# EAGLE schematic zik-pcb-sbc-ez80stm100p-r3 (EAGLE 6.5.0)
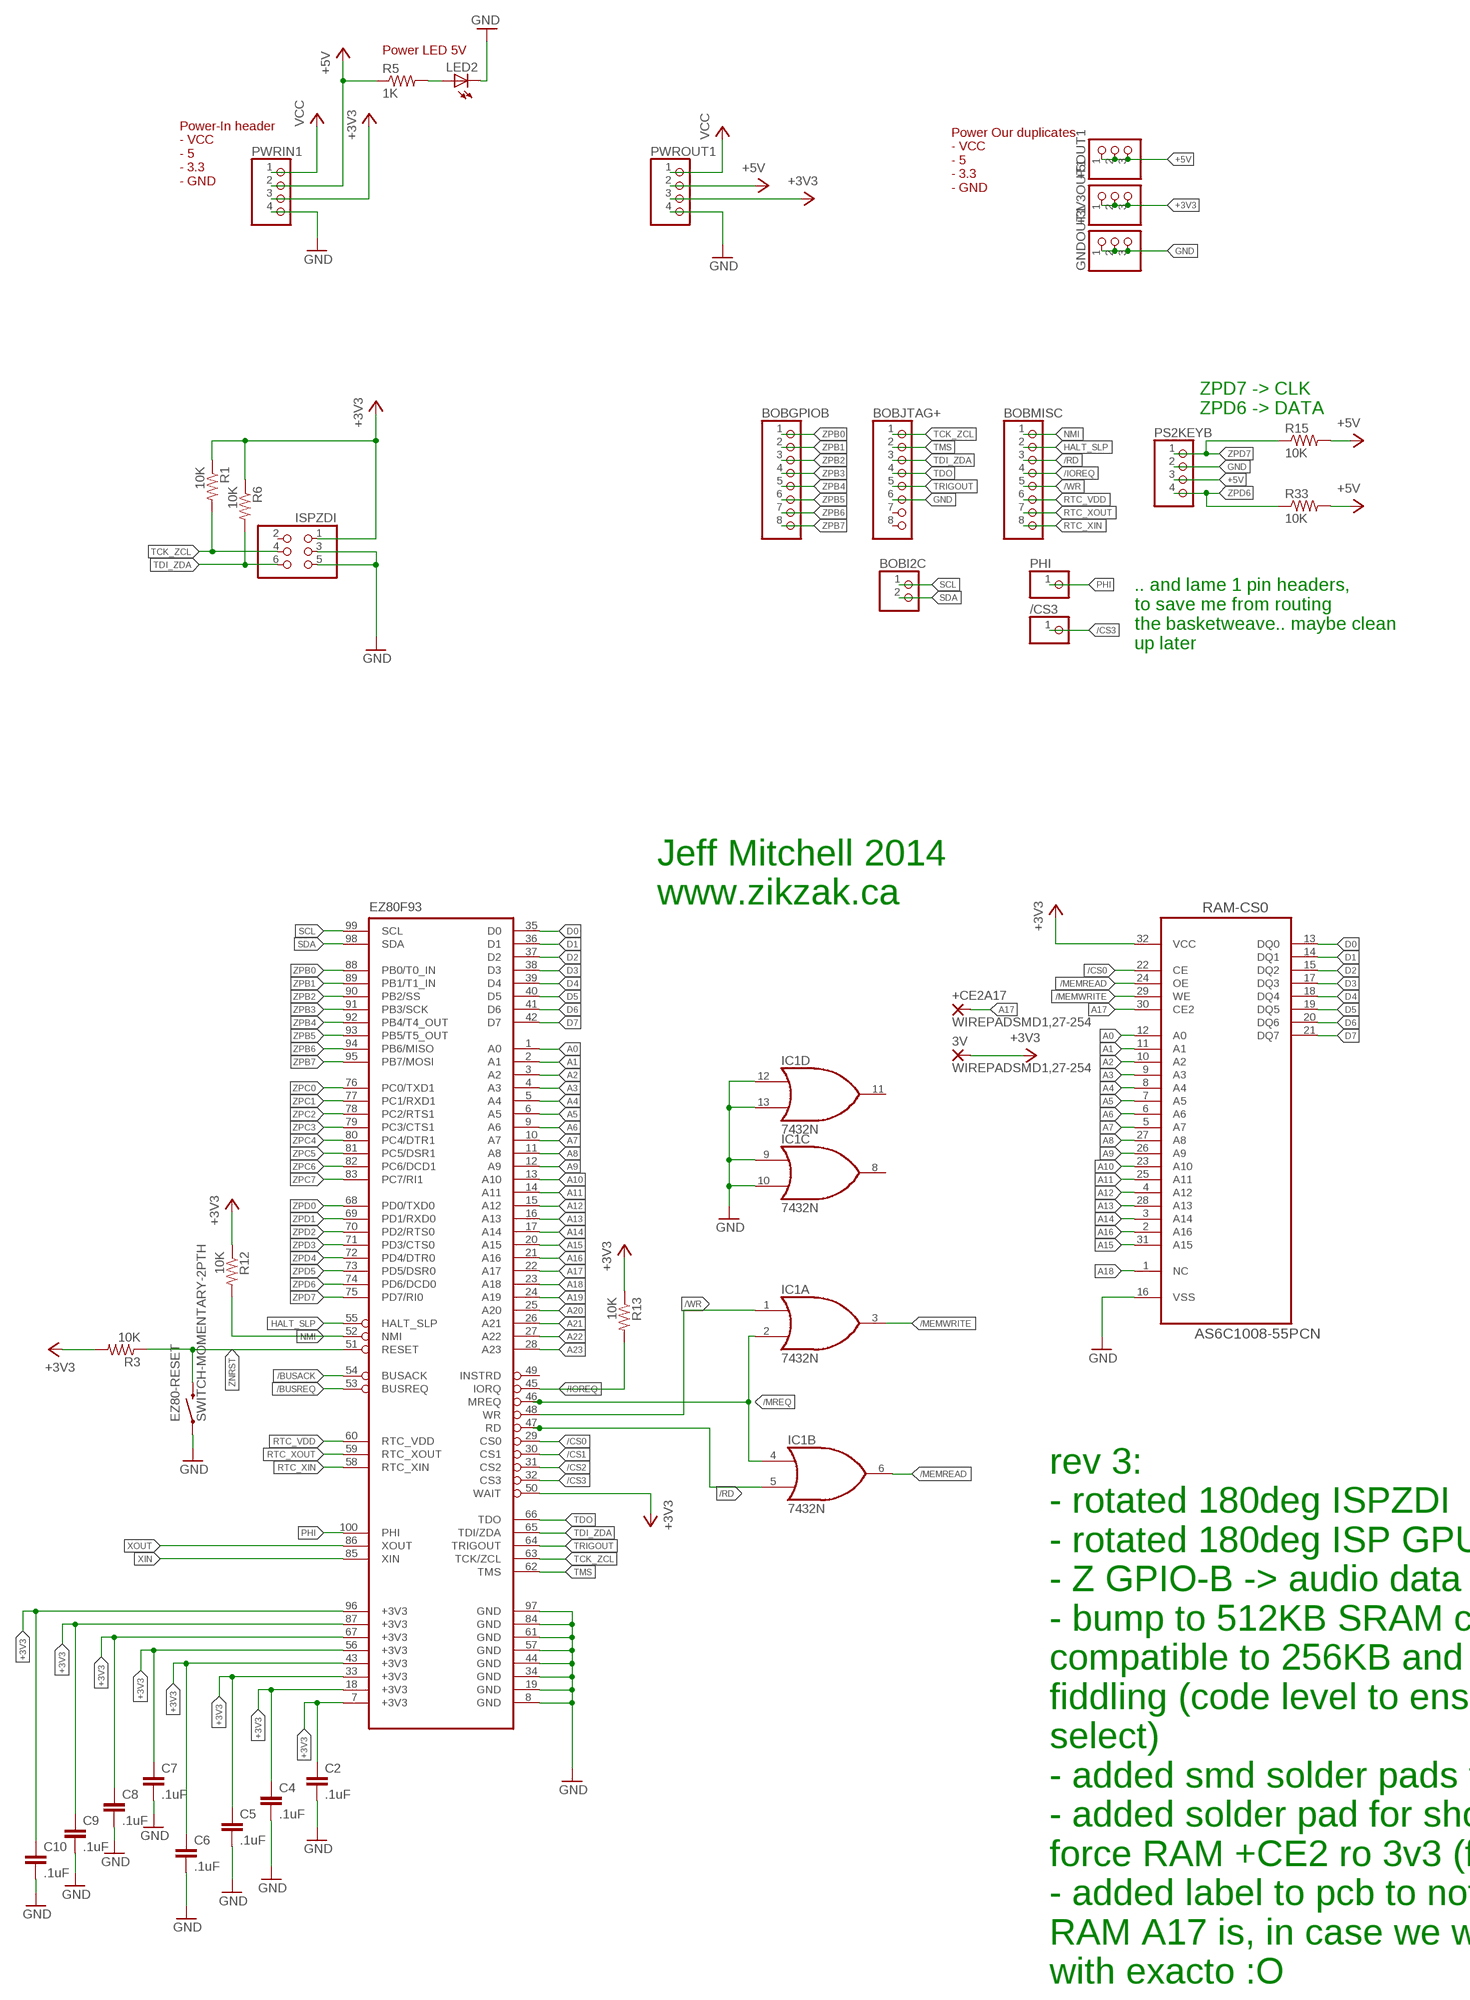
[diagram p0: schematic, sheet 1, part 1 of 3]
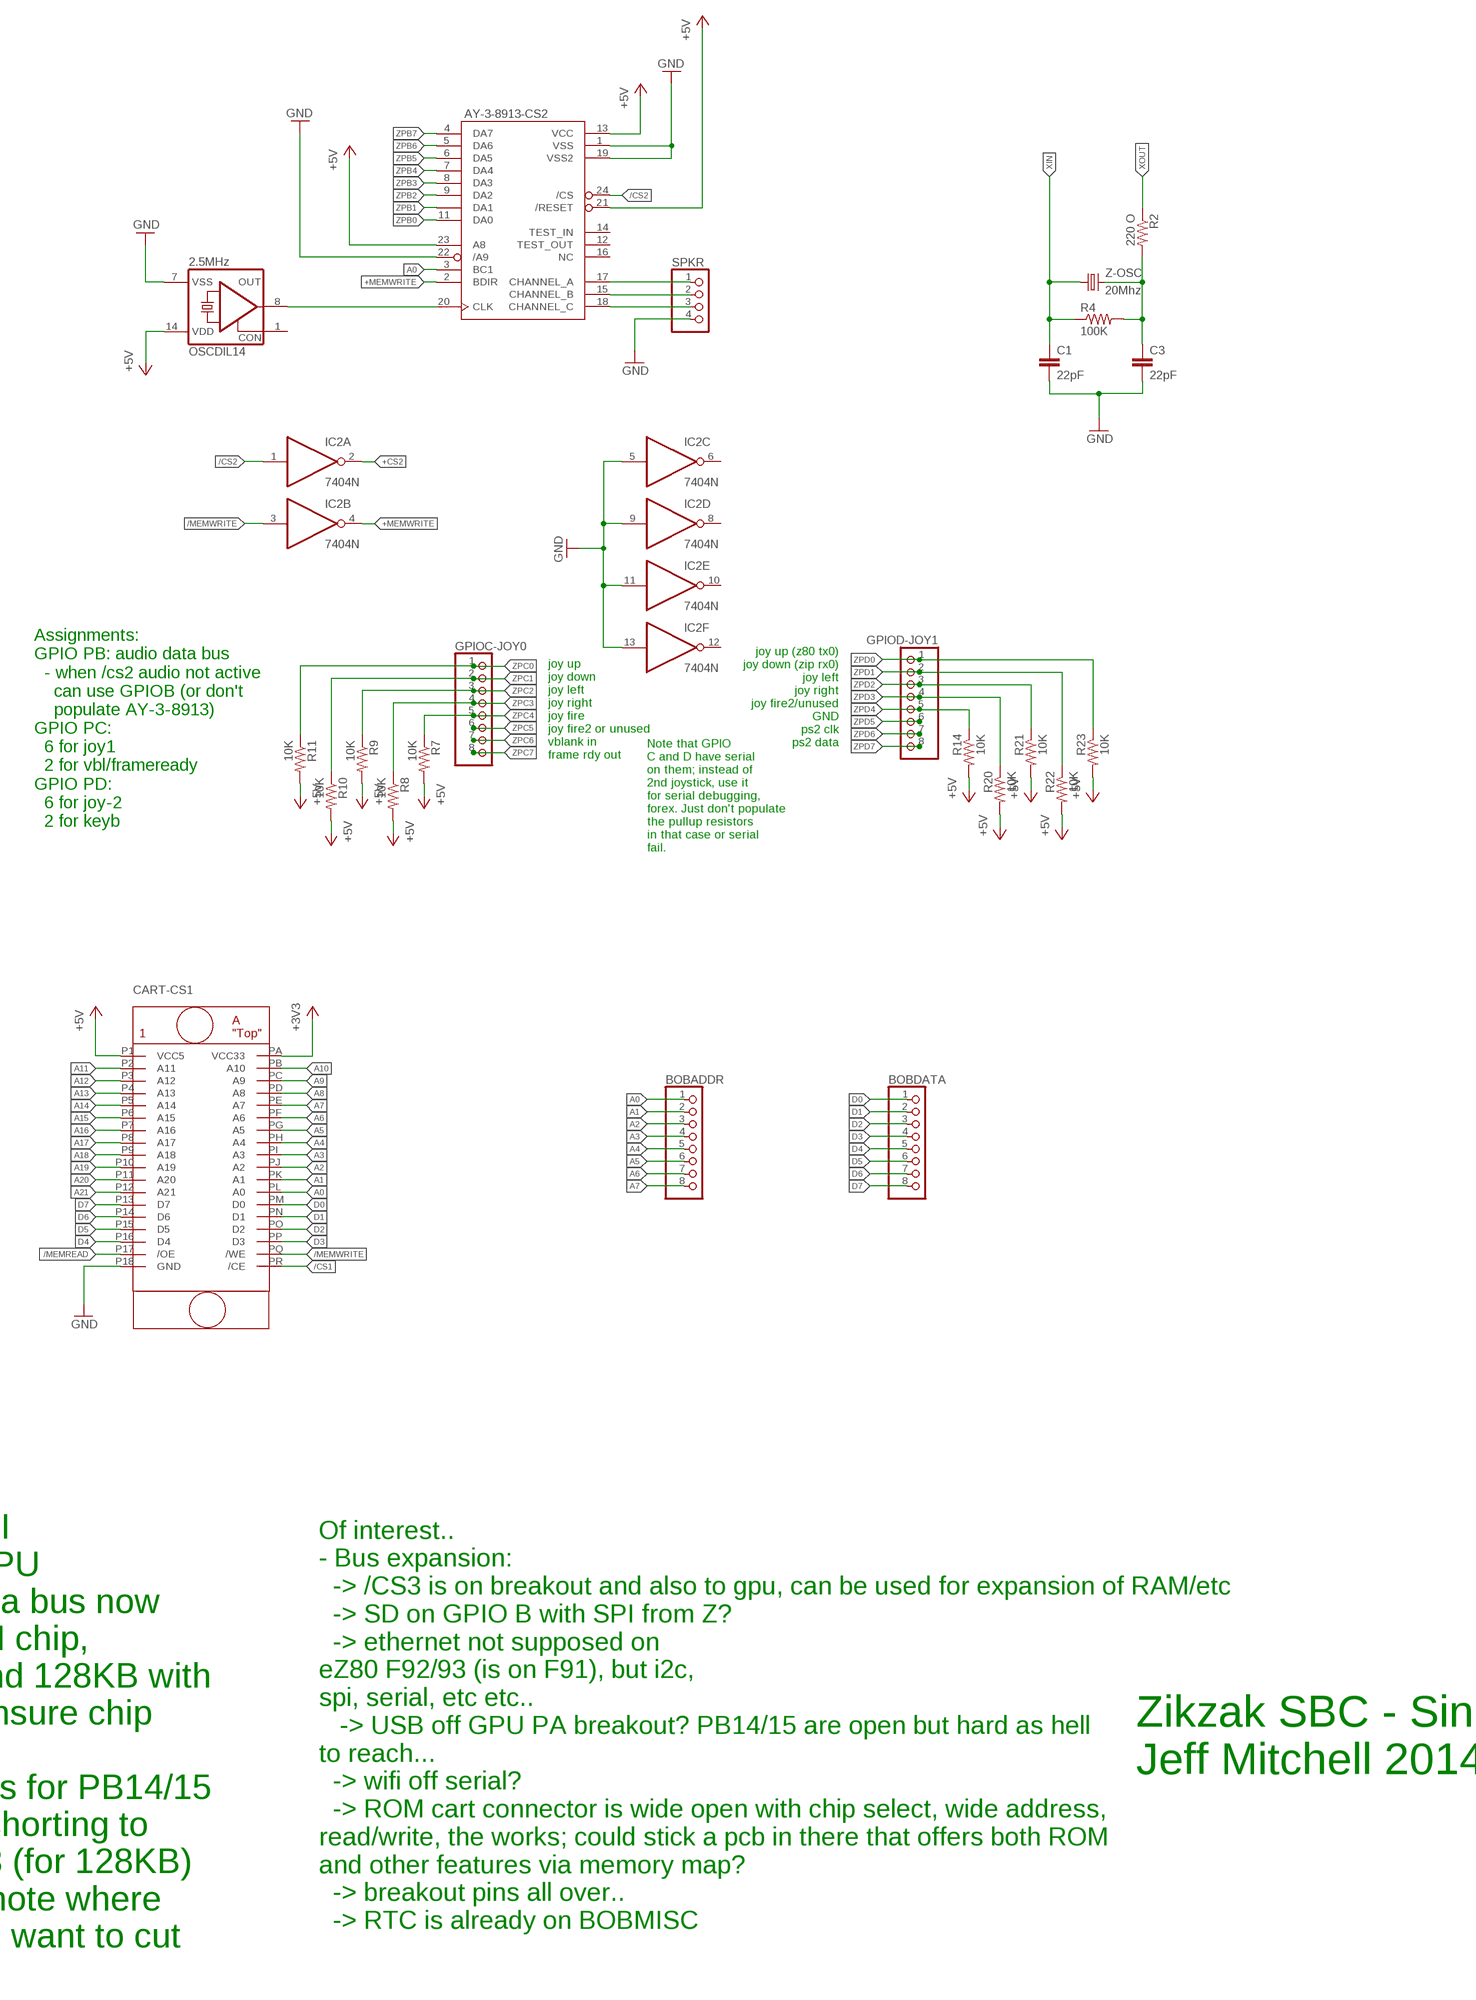
[diagram p1: schematic, sheet 1, part 2 of 3]
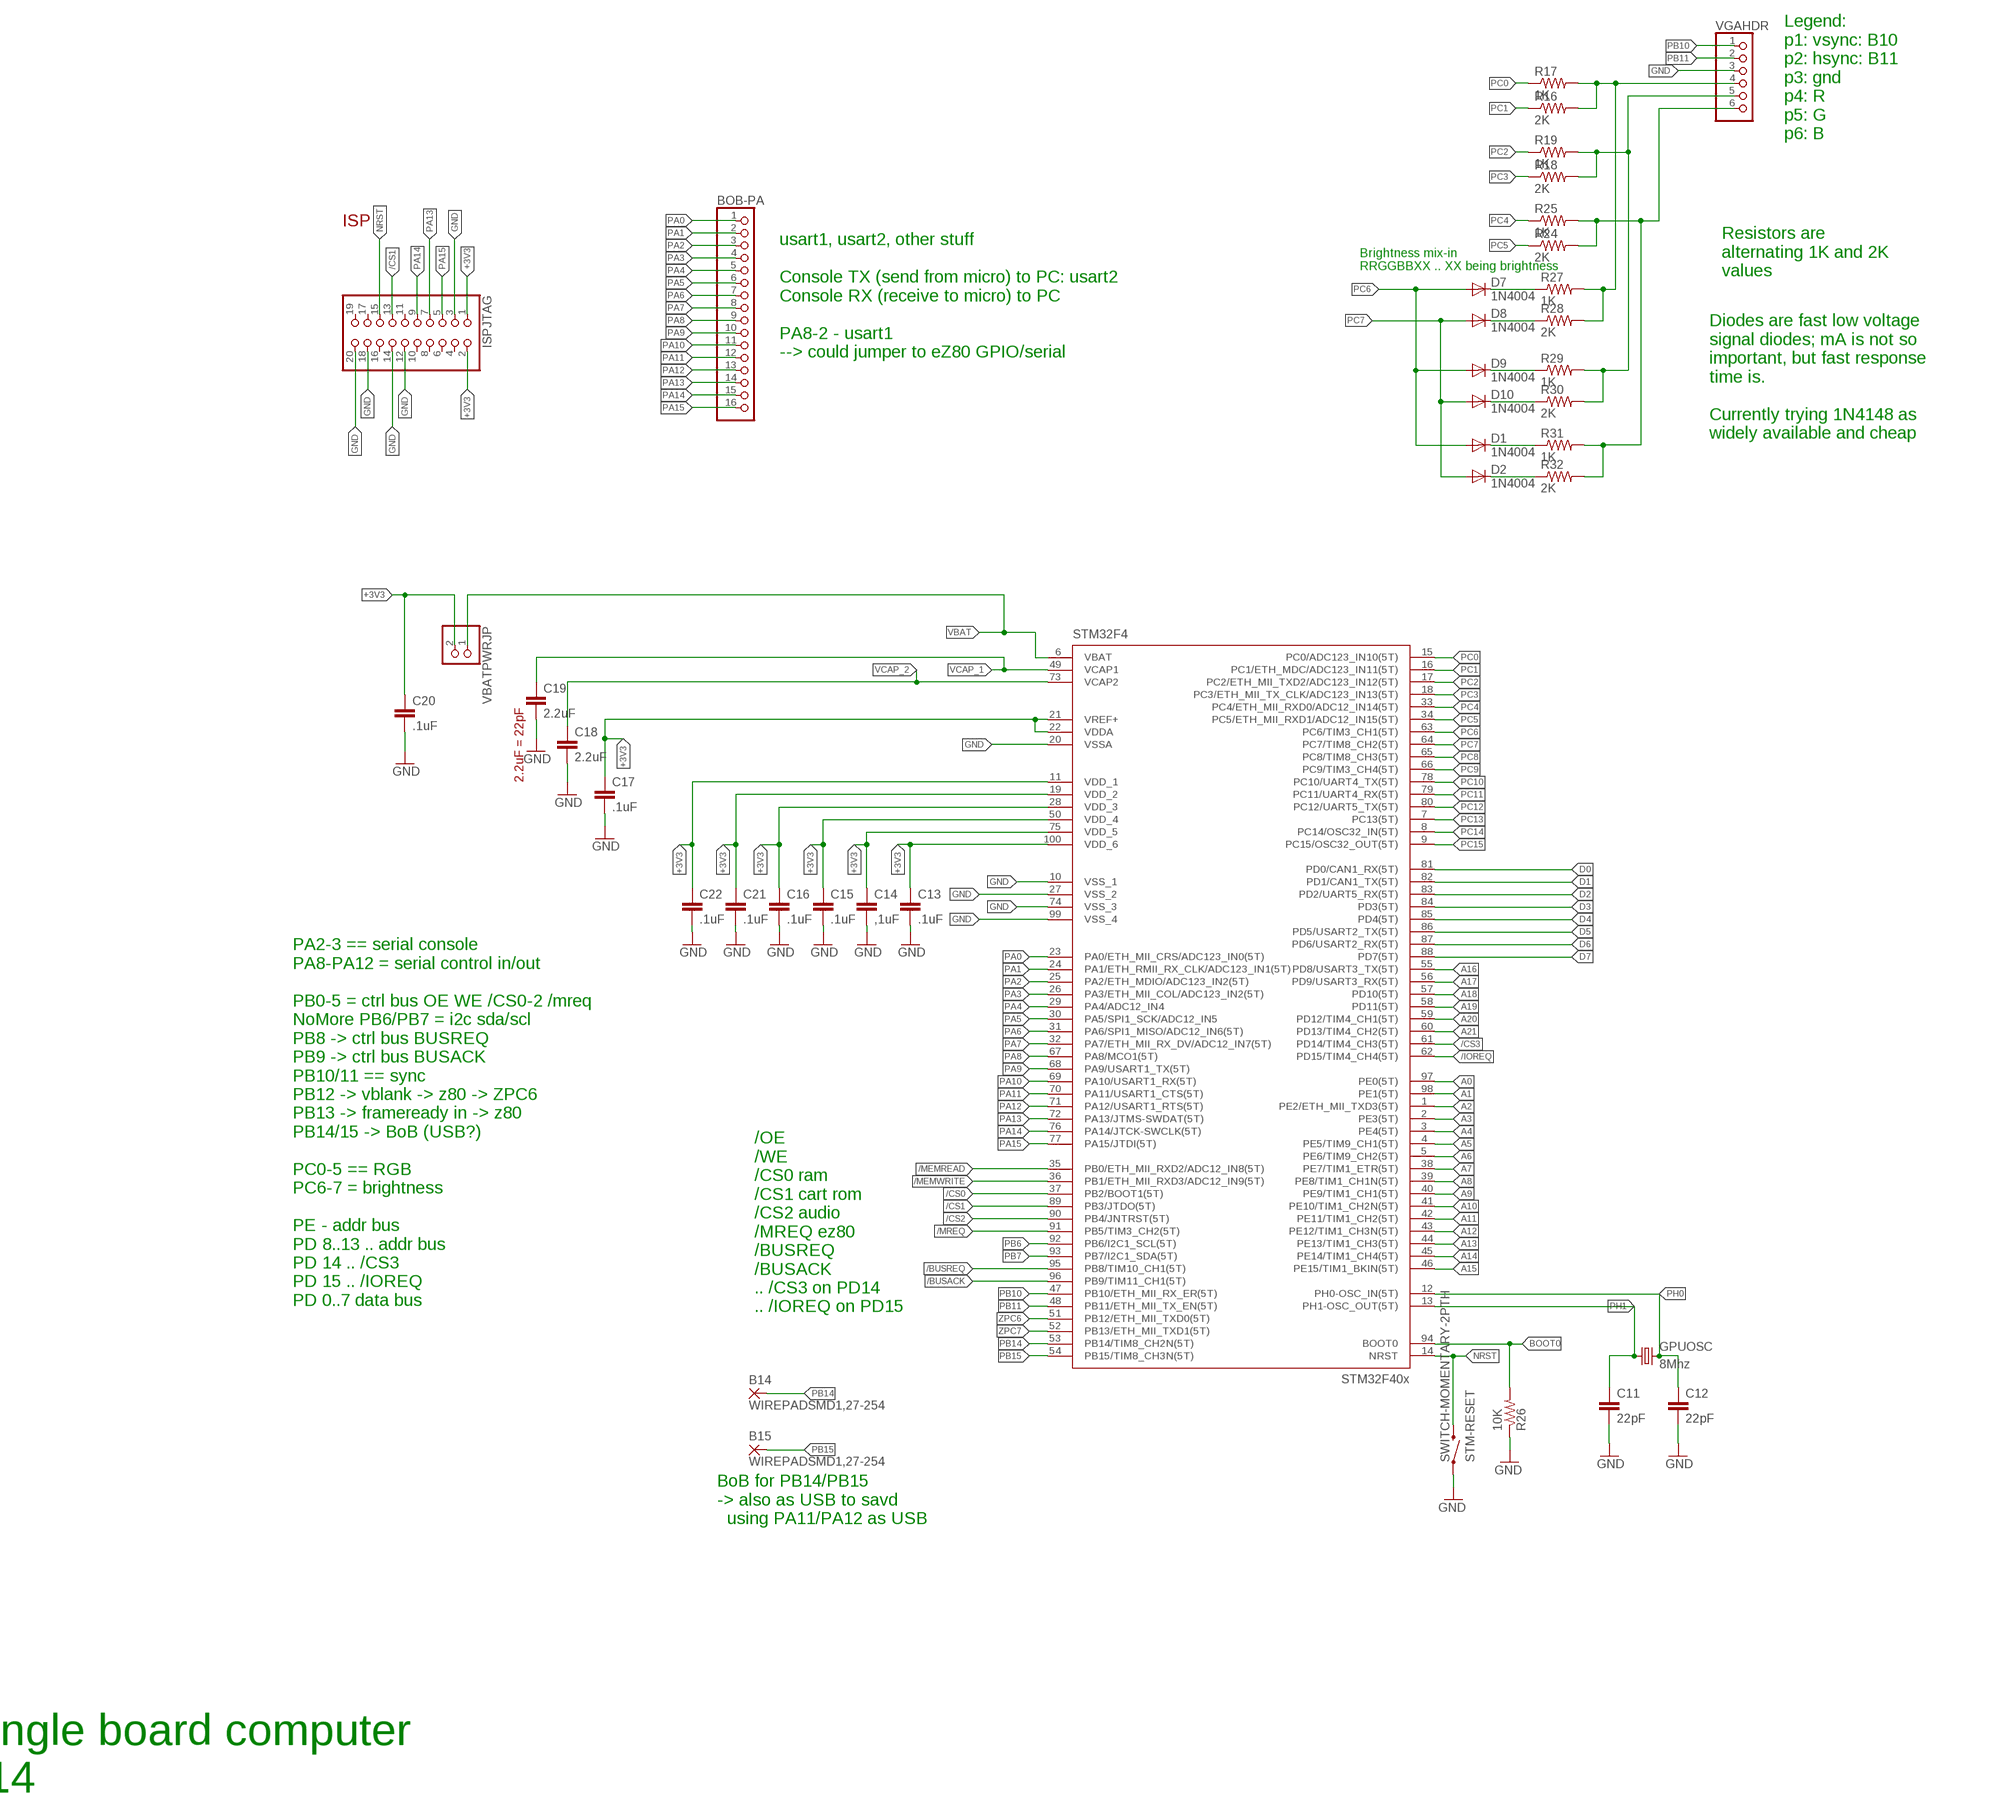
[diagram p2: schematic, sheet 1, part 3 of 3]

## Parts
3V  WIREPADSMD1,27-254  [SMD1,27-2,54]
+3V3OUT1  PINHD-1X3  [1X03]
+5OUT1  PINHD-1X3  [1X03]
+CE2A17  WIREPADSMD1,27-254  [SMD1,27-2,54]
/CS3  PINHD-1X1  [1X01]
AY-3-8913-CS2  AY-3-8912_24PIN-6  [DIL24-6]
B14  WIREPADSMD1,27-254  [SMD1,27-2,54]
B15  WIREPADSMD1,27-254  [SMD1,27-2,54]
BOB-PA  PINHD-1X16  [1X16]
BOBADDR  PINHD-1X8  [1X08]
BOBDATA  PINHD-1X8  [1X08]
BOBGPIOB  PINHD-1X8  [1X08]
BOBI2C  PINHD-1X2  [1X02]
BOBJTAG+  PINHD-1X8  [1X08]
BOBMISC  PINHD-1X8  [1X08]
C1  22pF  C-EU025-025X050  [C025-025X050]
C2  .1uF  C-EU025-025X050  [C025-025X050]
C3  22pF  C-EU025-025X050  [C025-025X050]
C4  .1uF  C-EU025-025X050  [C025-025X050]
C5  .1uF  C-EU025-025X050  [C025-025X050]
C6  .1uF  C-EU025-025X050  [C025-025X050]
C7  .1uF  C-EU025-025X050  [C025-025X050]
C8  .1uF  C-EU025-025X050  [C025-025X050]
C9  .1uF  C-EU025-025X050  [C025-025X050]
C10  .1uF  C-EU025-025X050  [C025-025X050]
C11  22pF  C-EU025-025X050  [C025-025X050]
C12  22pF  C-EU025-025X050  [C025-025X050]
C13  .1uF  C-EU025-025X050  [C025-025X050]
C14  ,1uF  C-EU025-025X050  [C025-025X050]
C15  .1uF  C-EU025-025X050  [C025-025X050]
C16  .1uF  C-EU025-025X050  [C025-025X050]
C17  .1uF  C-EU025-025X050  [C025-025X050]
C18  2.2uF  C-EU025-025X050  [C025-025X050]
C19  2.2uF  C-EU025-025X050  [C025-025X050]
C20  .1uF  C-EU025-025X050  [C025-025X050]
C21  .1uF  C-EU025-025X050  [C025-025X050]
C22  .1uF  C-EU025-025X050  [C025-025X050]
CART-CS1  ZIKCART36  [ZIKCARTSLOT]
D1  1N4004  [DO41-10]
D2  1N4004  [DO41-10]
D7  1N4004  [DO41-10]
D8  1N4004  [DO41-10]
D9  1N4004  [DO41-10]
D10  1N4004  [DO41-10]
EZ80-RESET  SWITCH-MOMENTARY-2PTH  [TACTILE-PTH]
EZ80F93  EZ80F92AZ  [SQFP-S-14X14-100]
GNDOUT1  PINHD-1X3  [1X03]
GPIOC-JOY0  PINHD-1X8  [1X08]
GPIOD-JOY1  PINHD-1X8  [1X08]
GPUOSC  8Mhz  CRYSTALHC49US  [HC49US]
IC1  7432N  [DIL14]
IC2  7404N  [DIL14]
ISPJTAG  PINHD-2X10  [2X10]
ISPZDI  PINHD-2X3  [2X03]
LED2  LED5MM  [LED5MM]
OSCDIL14  2.5MHz  CRYSTAL_RES-SG51  [SG51]
PHI  PINHD-1X1  [1X01]
PS2KEYB  PINHD-1X4  [1X04]
PWRIN1  PINHD-1X4  [1X04]
PWROUT1  PINHD-1X4  [1X04]
R1  10K  R-US_0204/7  [0204/7]
R2  220 O  R-US_0204/7  [0204/7]
R3  10K  R-US_0204/7  [0204/7]
R4  100K  R-US_0204/7  [0204/7]
R5  1K  R-US_0207/10  [0207/10]
R6  10K  R-US_0204/7  [0204/7]
R7  10K  R-US_0204/7  [0204/7]
R8  10K  R-US_0204/7  [0204/7]
R9  10K  R-US_0204/7  [0204/7]
R10  10K  R-US_0204/7  [0204/7]
R11  10K  R-US_0204/7  [0204/7]
R12  10K  R-US_0204/7  [0204/7]
R13  10K  R-US_0204/7  [0204/7]
R14  10K  R-US_0204/7  [0204/7]
R15  10K  R-US_0204/7  [0204/7]
R16  2K  R-US_0207/10  [0207/10]
R17  1K  R-US_0207/10  [0207/10]
R18  2K  R-US_0207/10  [0207/10]
R19  1K  R-US_0207/10  [0207/10]
R20  10K  R-US_0204/7  [0204/7]
R21  10K  R-US_0204/7  [0204/7]
R22  10K  R-US_0204/7  [0204/7]
R23  10K  R-US_0204/7  [0204/7]
R24  2K  R-US_0207/10  [0207/10]
R25  1K  R-US_0207/10  [0207/10]
R26  10K  R-US_0207/10  [0207/10]
R27  1K  R-US_0207/10  [0207/10]
R28  2K  R-US_0207/10  [0207/10]
R29  1K  R-US_0207/10  [0207/10]
R30  2K  R-US_0207/10  [0207/10]
R31  1K  R-US_0207/10  [0207/10]
R32  2K  R-US_0207/10  [0207/10]
R33  10K  R-US_0204/7  [0204/7]
RAM-CS0  AS6C1008-55PCN  [DIP254P1524X393-32]
SPKR  PINHD-1X4  [1X04]
STM32F4  STM32F407V  [TQFP100]
STM-RESET  SWITCH-MOMENTARY-2PTH  [TACTILE-PTH]
VBATPWRJP  PINHD-1X2  [1X02]
VGAHDR  PINHD-1X6  [1X06]
Z-OSC  20Mhz  CRYSTALHC49US  [HC49US]

## Nets
+3V3: 3V.1(P) +3V3OUT1.1 +3V3OUT1.2 +3V3OUT1.3 C2.1 C4.1 C5.1 C6.1 C7.1 C8.1 C9.1 C10.1 C13.1 C14.1 C15.1 C16.1 C17.1 C20.1 C21.1 C22.1 CART-CS1.PA(VCC33) EZ80F93.7(+3V3) EZ80F93.18(+3V3) EZ80F93.33(+3V3) EZ80F93.43(+3V3) EZ80F93.50(WAIT) EZ80F93.56(+3V3) EZ80F93.67(+3V3) EZ80F93.87(+3V3) EZ80F93.96(+3V3) ISPJTAG.1 ISPJTAG.2 ISPZDI.1 PWRIN1.3 PWROUT1.3 R1.1 R3.2 R6.1 R12.1 R13.1 RAM-CS0.32(VCC) STM32F4.11(VDD_1) STM32F4.19(VDD_2) STM32F4.21(VREF+) STM32F4.22(VDDA) STM32F4.28(VDD_3) STM32F4.50(VDD_4) STM32F4.75(VDD_5) STM32F4.100(VDD_6) VBATPWRJP.2
+5V: +5OUT1.1 +5OUT1.2 +5OUT1.3 AY-3-8913-CS2.13(VCC) AY-3-8913-CS2.21(/RESET) AY-3-8913-CS2.23(A8) CART-CS1.P1(VCC5) OSCDIL14.14(VDD) PS2KEYB.3 PWRIN1.2 PWROUT1.2 R5.1 R7.2 R8.2 R9.2 R10.2 R11.2 R14.2 R15.2 R20.2 R21.2 R22.2 R23.2 R33.2
+CS2: IC2.2(A:O)
+MEMWRITE: AY-3-8913-CS2.2(BDIR) IC2.4(B:O)
/BUSACK: EZ80F93.54(BUSACK) STM32F4.96(PB9/TIM11_CH1(5T))
/BUSREQ: EZ80F93.53(BUSREQ) STM32F4.95(PB8/TIM10_CH1(5T))
/CS0: EZ80F93.29(CS0) RAM-CS0.22(CE) STM32F4.37(PB2/BOOT1(5T))
/CS1: CART-CS1.PR(/CE) EZ80F93.30(CS1) ISPJTAG.13 STM32F4.89(PB3/JTDO(5T))
/CS2: AY-3-8913-CS2.24(/CS) EZ80F93.31(CS2) IC2.1(A:I) STM32F4.90(PB4/JNTRST(5T))
/CS3: /CS3.1 EZ80F93.32(CS3) STM32F4.61(PD14/TIM4_CH3(5T))
/IOREQ: BOBMISC.4 EZ80F93.45(IORQ) R13.2 STM32F4.62(PD15/TIM4_CH4(5T))
/MEMREAD: CART-CS1.P17(/OE) IC1.6(B:O) RAM-CS0.24(OE) STM32F4.35(PB0/ETH_MII_RXD2/ADC12_IN8(5T))
/MEMWRITE: CART-CS1.PQ(/WE) IC1.3(A:O) IC2.3(B:I) RAM-CS0.29(WE) STM32F4.36(PB1/ETH_MII_RXD3/ADC12_IN9(5T))
/MREQ: EZ80F93.46(MREQ) IC1.2(A:I1) IC1.4(B:I0) STM32F4.91(PB5/TIM3_CH2(5T))
/RD: BOBMISC.3 EZ80F93.47(RD) IC1.5(B:I1)
/WR: BOBMISC.5 EZ80F93.48(WR) IC1.1(A:I0)
A0: AY-3-8913-CS2.3(BC1) BOBADDR.1 CART-CS1.PL(A0) EZ80F93.1(A0) RAM-CS0.12(A0) STM32F4.97(PE0(5T))
A1: BOBADDR.2 CART-CS1.PK(A1) EZ80F93.2(A1) RAM-CS0.11(A1) STM32F4.98(PE1(5T))
A2: BOBADDR.3 CART-CS1.PJ(A2) EZ80F93.3(A2) RAM-CS0.10(A2) STM32F4.1(PE2/ETH_MII_TXD3(5T))
A3: BOBADDR.4 CART-CS1.PI(A3) EZ80F93.4(A3) RAM-CS0.9(A3) STM32F4.2(PE3(5T))
A4: BOBADDR.5 CART-CS1.PH(A4) EZ80F93.5(A4) RAM-CS0.8(A4) STM32F4.3(PE4(5T))
A5: BOBADDR.6 CART-CS1.PG(A5) EZ80F93.6(A5) RAM-CS0.7(A5) STM32F4.4(PE5/TIM9_CH1(5T))
A6: BOBADDR.7 CART-CS1.PF(A6) EZ80F93.9(A6) RAM-CS0.6(A6) STM32F4.5(PE6/TIM9_CH2(5T))
A7: BOBADDR.8 CART-CS1.PE(A7) EZ80F93.10(A7) RAM-CS0.5(A7) STM32F4.38(PE7/TIM1_ETR(5T))
A8: CART-CS1.PD(A8) EZ80F93.11(A8) RAM-CS0.27(A8) STM32F4.39(PE8/TIM1_CH1N(5T))
A9: CART-CS1.PC(A9) EZ80F93.12(A9) RAM-CS0.26(A9) STM32F4.40(PE9/TIM1_CH1(5T))
A10: CART-CS1.PB(A10) EZ80F93.13(A10) RAM-CS0.23(A10) STM32F4.41(PE10/TIM1_CH2N(5T))
A11: CART-CS1.P2(A11) EZ80F93.14(A11) RAM-CS0.25(A11) STM32F4.42(PE11/TIM1_CH2(5T))
A12: CART-CS1.P3(A12) EZ80F93.15(A12) RAM-CS0.4(A12) STM32F4.43(PE12/TIM1_CH3N(5T))
A13: CART-CS1.P4(A13) EZ80F93.16(A13) RAM-CS0.28(A13) STM32F4.44(PE13/TIM1_CH3(5T))
A14: CART-CS1.P5(A14) EZ80F93.17(A14) RAM-CS0.3(A14) STM32F4.45(PE14/TIM1_CH4(5T))
A15: CART-CS1.P6(A15) EZ80F93.20(A15) RAM-CS0.31(A15) STM32F4.46(PE15/TIM1_BKIN(5T))
A16: CART-CS1.P7(A16) EZ80F93.21(A16) RAM-CS0.2(A16) STM32F4.55(PD8/USART3_TX(5T))
A17: +CE2A17.1(P) CART-CS1.P8(A17) EZ80F93.22(A17) RAM-CS0.30(CE2) STM32F4.56(PD9/USART3_RX(5T))
A18: CART-CS1.P9(A18) EZ80F93.23(A18) RAM-CS0.1(NC) STM32F4.57(PD10(5T))
A19: CART-CS1.P10(A19) EZ80F93.24(A19) STM32F4.58(PD11(5T))
A20: CART-CS1.P11(A20) EZ80F93.25(A20) STM32F4.59(PD12/TIM4_CH1(5T))
A21: CART-CS1.P12(A21) EZ80F93.26(A21) STM32F4.60(PD13/TIM4_CH2(5T))
A22: EZ80F93.27(A22)
A23: EZ80F93.28(A23)
BOOT0: R26.2 STM32F4.94(BOOT0)
D0: BOBDATA.1 CART-CS1.PM(D0) EZ80F93.35(D0) RAM-CS0.13(DQ0) STM32F4.81(PD0/CAN1_RX(5T))
D1: BOBDATA.2 CART-CS1.PN(D1) EZ80F93.36(D1) RAM-CS0.14(DQ1) STM32F4.82(PD1/CAN1_TX(5T))
D2: BOBDATA.3 CART-CS1.PO(D2) EZ80F93.37(D2) RAM-CS0.15(DQ2) STM32F4.83(PD2/UART5_RX(5T))
D3: BOBDATA.4 CART-CS1.PP(D3) EZ80F93.38(D3) RAM-CS0.17(DQ3) STM32F4.84(PD3(5T))
D4: BOBDATA.5 CART-CS1.P16(D4) EZ80F93.39(D4) RAM-CS0.18(DQ4) STM32F4.85(PD4(5T))
D5: BOBDATA.6 CART-CS1.P15(D5) EZ80F93.40(D5) RAM-CS0.19(DQ5) STM32F4.86(PD5/USART2_TX(5T))
D6: BOBDATA.7 CART-CS1.P14(D6) EZ80F93.41(D6) RAM-CS0.20(DQ6) STM32F4.87(PD6/USART2_RX(5T))
D7: BOBDATA.8 CART-CS1.P13(D7) EZ80F93.42(D7) RAM-CS0.21(DQ7) STM32F4.88(PD7(5T))
GND: AY-3-8913-CS2.1(VSS) AY-3-8913-CS2.19(VSS2) AY-3-8913-CS2.22(/A9) BOBJTAG+.6 C1.2 C2.2 C3.2 C4.2 C5.2 C6.2 C7.2 C8.2 C9.2 C10.2 C11.2 C12.2 C13.2 C14.2 C15.2 C16.2 C17.2 C18.2 C19.2 C20.2 C21.2 C22.2 CART-CS1.P18(GND) EZ80-RESET.1 EZ80F93.8(GND) EZ80F93.19(GND) EZ80F93.34(GND) EZ80F93.44(GND) EZ80F93.57(GND) EZ80F93.61(GND) EZ80F93.84(GND) EZ80F93.97(GND) GNDOUT1.1 GNDOUT1.2 GNDOUT1.3 IC1.9(C:I0) IC1.10(C:I1) IC1.12(D:I0) IC1.13(D:I1) IC2.5(C:I) IC2.9(D:I) IC2.11(E:I) IC2.13(F:I) ISPJTAG.3 ISPJTAG.12 ISPJTAG.14 ISPJTAG.18 ISPJTAG.20 ISPZDI.3 ISPZDI.5 LED2.K(C) OSCDIL14.7(VSS) PS2KEYB.2 PWRIN1.4 PWROUT1.4 R26.1 RAM-CS0.16(VSS) SPKR.4 STM32F4.10(VSS_1) STM32F4.20(VSSA) STM32F4.27(VSS_2) STM32F4.74(VSS_3) STM32F4.99(VSS_4) STM-RESET.1 VGAHDR.3
HALT_SLP: BOBMISC.2 EZ80F93.55(HALT_SLP)
N$1: C3.1 R2.2 R4.2 Z-OSC.2
N$2: LED2.A R5.2
N$4: R24.2 R25.2 R31.2 R32.2 VGAHDR.6
N$5: R18.2 R19.2 R29.2 R30.2 VGAHDR.5
N$6: D7.C R27.1
N$7: D8.C R28.1
N$11: AY-3-8913-CS2.20(CLK) OSCDIL14.8(OUT)
N$12: R16.2 R17.2 R27.2 R28.2 VGAHDR.4
N$13: D9.C R29.1
N$14: D10.C R30.1
N$17: D1.C R31.1
N$19: D2.C R32.1
N$26: AY-3-8913-CS2.17(CHANNEL_A) SPKR.1
N$27: AY-3-8913-CS2.15(CHANNEL_B) SPKR.2
N$28: AY-3-8913-CS2.18(CHANNEL_C) SPKR.3
NMI: BOBMISC.1 EZ80F93.52(NMI) R12.2
NRST: ISPJTAG.15 STM32F4.14(NRST) STM-RESET.3
PA0: BOB-PA.1 STM32F4.23(PA0/ETH_MII_CRS/ADC123_IN0(5T))
PA1: BOB-PA.2 STM32F4.24(PA1/ETH_RMII_RX_CLK/ADC123_IN1(5T))
PA2: BOB-PA.3 STM32F4.25(PA2/ETH_MDIO/ADC123_IN2(5T))
PA3: BOB-PA.4 STM32F4.26(PA3/ETH_MII_COL/ADC123_IN2(5T))
PA4: BOB-PA.5 STM32F4.29(PA4/ADC12_IN4)
PA5: BOB-PA.6 STM32F4.30(PA5/SPI1_SCK/ADC12_IN5)
PA6: BOB-PA.7 STM32F4.31(PA6/SPI1_MISO/ADC12_IN6(5T))
PA7: BOB-PA.8 STM32F4.32(PA7/ETH_MII_RX_DV/ADC12_IN7(5T))
PA8: BOB-PA.9 STM32F4.67(PA8/MCO1(5T))
PA9: BOB-PA.10 STM32F4.68(PA9/USART1_TX(5T))
PA10: BOB-PA.11 STM32F4.69(PA10/USART1_RX(5T))
PA11: BOB-PA.12 STM32F4.70(PA11/USART1_CTS(5T))
PA12: BOB-PA.13 STM32F4.71(PA12/USART1_RTS(5T))
PA13: BOB-PA.14 ISPJTAG.7 STM32F4.72(PA13/JTMS-SWDAT(5T))
PA14: BOB-PA.15 ISPJTAG.9 STM32F4.76(PA14/JTCK-SWCLK(5T))
PA15: BOB-PA.16 ISPJTAG.5 STM32F4.77(PA15/JTDI(5T))
PB6: STM32F4.92(PB6/I2C1_SCL(5T))
PB7: STM32F4.93(PB7/I2C1_SDA(5T))
PB10: STM32F4.47(PB10/ETH_MII_RX_ER(5T)) VGAHDR.1
PB11: STM32F4.48(PB11/ETH_MII_TX_EN(5T)) VGAHDR.2
PB14: B14.1(P) STM32F4.53(PB14/TIM8_CH2N(5T))
PB15: B15.1(P) STM32F4.54(PB15/TIM8_CH3N(5T))
PC0: R17.1 STM32F4.15(PC0/ADC123_IN10(5T))
PC1: R16.1 STM32F4.16(PC1/ETH_MDC/ADC123_IN11(5T))
PC2: R19.1 STM32F4.17(PC2/ETH_MII_TXD2/ADC123_IN12(5T))
PC3: R18.1 STM32F4.18(PC3/ETH_MII_TX_CLK/ADC123_IN13(5T))
PC4: R25.1 STM32F4.33(PC4/ETH_MII_RXD0/ADC12_IN14(5T))
PC5: R24.1 STM32F4.34(PC5/ETH_MII_RXD1/ADC12_IN15(5T))
PC6: D1.A D7.A D9.A STM32F4.63(PC6/TIM3_CH1(5T))
PC7: D2.A D8.A D10.A STM32F4.64(PC7/TIM8_CH2(5T))
PC8: STM32F4.65(PC8/TIM8_CH3(5T))
PC9: STM32F4.66(PC9/TIM3_CH4(5T))
PC10: STM32F4.78(PC10/UART4_TX(5T))
PC11: STM32F4.79(PC11/UART4_RX(5T))
PC12: STM32F4.80(PC12/UART5_TX(5T))
PC13: STM32F4.7(PC13(5T))
PC14: STM32F4.8(PC14/OSC32_IN(5T))
PC15: STM32F4.9(PC15/OSC32_OUT(5T))
PH0: C12.1 GPUOSC.2 STM32F4.12(PH0-OSC_IN(5T))
PH1: C11.1 GPUOSC.1 STM32F4.13(PH1-OSC_OUT(5T))
PHI: EZ80F93.100(PHI) PHI.1
RTC_VDD: BOBMISC.6 EZ80F93.60(RTC_VDD)
RTC_XIN: BOBMISC.8 EZ80F93.58(RTC_XIN)
RTC_XOUT: BOBMISC.7 EZ80F93.59(RTC_XOUT)
SCL: BOBI2C.1 EZ80F93.99(SCL)
SDA: BOBI2C.2 EZ80F93.98(SDA)
TCK_ZCL: BOBJTAG+.1 EZ80F93.63(TCK/ZCL) ISPZDI.4 R1.2
TDI_ZDA: BOBJTAG+.3 EZ80F93.65(TDI/ZDA) ISPZDI.6 R6.2
TDO: BOBJTAG+.4 EZ80F93.66(TDO)
TMS: BOBJTAG+.2 EZ80F93.62(TMS)
TRIGOUT: BOBJTAG+.5 EZ80F93.64(TRIGOUT)
VBAT: STM32F4.6(VBAT) VBATPWRJP.1
VCAP_1: C19.1 STM32F4.49(VCAP1)
VCAP_2: C18.1 STM32F4.73(VCAP2)
VCC: PWRIN1.1 PWROUT1.1
XIN: C1.1 EZ80F93.85(XIN) R4.1 Z-OSC.1
XOUT: EZ80F93.86(XOUT) R2.1
ZNRST: EZ80-RESET.3 EZ80F93.51(RESET) R3.1
ZPB0: AY-3-8913-CS2.11(DA0) BOBGPIOB.1 EZ80F93.88(PB0/T0_IN)
ZPB1: AY-3-8913-CS2.10(DA1) BOBGPIOB.2 EZ80F93.89(PB1/T1_IN)
ZPB2: AY-3-8913-CS2.9(DA2) BOBGPIOB.3 EZ80F93.90(PB2/SS)
ZPB3: AY-3-8913-CS2.8(DA3) BOBGPIOB.4 EZ80F93.91(PB3/SCK)
ZPB4: AY-3-8913-CS2.7(DA4) BOBGPIOB.5 EZ80F93.92(PB4/T4_OUT)
ZPB5: AY-3-8913-CS2.6(DA5) BOBGPIOB.6 EZ80F93.93(PB5/T5_OUT)
ZPB6: AY-3-8913-CS2.5(DA6) BOBGPIOB.7 EZ80F93.94(PB6/MISO)
ZPB7: AY-3-8913-CS2.4(DA7) BOBGPIOB.8 EZ80F93.95(PB7/MOSI)
ZPC0: EZ80F93.76(PC0/TXD1) GPIOC-JOY0.1 R11.1
ZPC1: EZ80F93.77(PC1/RXD1) GPIOC-JOY0.2 R10.1
ZPC2: EZ80F93.78(PC2/RTS1) GPIOC-JOY0.3 R9.1
ZPC3: EZ80F93.79(PC3/CTS1) GPIOC-JOY0.4 R8.1
ZPC4: EZ80F93.80(PC4/DTR1) GPIOC-JOY0.5 R7.1
ZPC5: EZ80F93.81(PC5/DSR1) GPIOC-JOY0.6
ZPC6: EZ80F93.82(PC6/DCD1) GPIOC-JOY0.7 STM32F4.51(PB12/ETH_MII_TXD0(5T))
ZPC7: EZ80F93.83(PC7/RI1) GPIOC-JOY0.8 STM32F4.52(PB13/ETH_MII_TXD1(5T))
ZPD0: EZ80F93.68(PD0/TXD0) GPIOD-JOY1.1 R23.1
ZPD1: EZ80F93.69(PD1/RXD0) GPIOD-JOY1.2 R22.1
ZPD2: EZ80F93.70(PD2/RTS0) GPIOD-JOY1.3 R21.1
ZPD3: EZ80F93.71(PD3/CTS0) GPIOD-JOY1.4 R20.1
ZPD4: EZ80F93.72(PD4/DTR0) GPIOD-JOY1.5 R14.1
ZPD5: EZ80F93.73(PD5/DSR0) GPIOD-JOY1.6
ZPD6: EZ80F93.74(PD6/DCD0) GPIOD-JOY1.7 PS2KEYB.4 R33.1
ZPD7: EZ80F93.75(PD7/RI0) GPIOD-JOY1.8 PS2KEYB.1 R15.1
Unconnected: AY-3-8913-CS2.12(TEST_OUT) AY-3-8913-CS2.14(TEST_IN) AY-3-8913-CS2.16(NC) BOBJTAG+.7 BOBJTAG+.8 EZ80F93.49(INSTRD) IC1.8(C:O) IC1.11(D:O) IC2.6(C:O) IC2.8(D:O) IC2.10(E:O) IC2.12(F:O) ISPJTAG.4 ISPJTAG.6 ISPJTAG.8 ISPJTAG.10 ISPJTAG.11 ISPJTAG.16 ISPJTAG.17 ISPJTAG.19 ISPZDI.2 OSCDIL14.1(CON)

## Notes on the sheet
- Legend:
  p1: vsync: B10
  p2: hsync: B11
  p3: gnd
  p4: R
  p5: G
  p6: B
- Power LED 5V
- ISP
- Brightness mix-in
  RRGGBBXX .. XX being brightness
- Resistors are
  alternating 1K and 2K
  values
- Power-In header
  - VCC
  - 5
  - 3.3
  - GND
- Power Our duplicates
  - VCC
  - 5
  - 3.3
  - GND
- usart1, usart2, other stuff
  
  Console TX (send from micro) to PC: usart2
  Console RX (receive to micro) to PC
  
  PA8-2 - usart1
  --> could jumper to eZ80 GPIO/serial
- Diodes are fast low voltage
  signal diodes; mA is not so
  important, but fast response
  time is.
  
  Currently trying 1N4148 as
  widely available and cheap
- ZPD7 -> CLK
  ZPD6 -> DATA
- .. and lame 1 pin headers,
  to save me from routing
  the basketweave.. maybe clean
  up later
- joy up (z80 tx0)
  joy down (zip rx0)
  joy left
  joy right
  joy fire2/unused
  GND
  ps2 clk
  ps2 data
- joy up
  joy down
  joy left
  joy right
  joy fire
  joy fire2 or unused
  vblank in
  frame rdy out
- 2.2uF = 22pF
- Assignments:
  GPIO PB: audio data bus
    - when /cs2 audio not active
      can use GPIOB (or don't
      populate AY-3-8913)
  GPIO PC:
    6 for joy1
    2 for vbl/frameready
  GPIO PD:
    6 for joy-2
    2 for keyb
- Note that GPIO
  C and D have serial
  on them; instead of
  2nd joystick, use it
  for serial debugging,
  forex. Just don't populate
  the pullup resistors
  in that case or serial
  fail.
- Jeff Mitchell 2014
  www.zikzak.ca
- PA2-3 == serial console
  PA8-PA12 = serial control in/out
  
  PB0-5 = ctrl bus OE WE /CS0-2 /mreq
  NoMore PB6/PB7 = i2c sda/scl 
  PB8 -> ctrl bus BUSREQ
  PB9 -> ctrl bus BUSACK
  PB10/11 == sync
  PB12 -> vblank -> z80 -> ZPC6
  PB13 -> frameready in -> z80
  PB14/15 -> BoB (USB?)
  
  PC0-5 == RGB
  PC6-7 = brightness
  
  PE - addr bus
  PD 8..13 .. addr bus
  PD 14 .. /CS3
  PD 15 .. /IOREQ
  PD 0..7 data bus
- /OE
  /WE
  /CS0 ram
  /CS1 cart rom
  /CS2 audio
  /MREQ ez80
  /BUSREQ
  /BUSACK
  .. /CS3 on PD14
  .. /IOREQ on PD15
- BoB for PB14/PB15
  -> also as USB to savd
    using PA11/PA12 as USB
- Zikzak SBC - Single board computer
  Jeff Mitchell 2014
- Of interest..
  - Bus expansion:
    -> /CS3 is on breakout and also to gpu, can be used for expansion of RAM/etc
    -> SD on GPIO B with SPI from Z?
    -> ethernet not supposed on
  eZ80 F92/93 (is on F91), but i2c,
  spi, serial, etc etc..
     -> USB off GPU PA breakout? PB14/15 are open but hard as hell
  to reach...
    -> wifi off serial?
    -> ROM cart connector is wide open with chip select, wide address,
  read/write, the works; could stick a pcb in there that offers both ROM
  and other features via memory map?
    -> breakout pins all over..
    -> RTC is already on BOBMISC
- rev 3:
  - rotated 180deg ISPZDI
  - rotated 180deg ISP GPU
  - Z GPIO-B -> audio data bus now
  - bump to 512KB SRAM chip,
  compatible to 256KB and 128KB with
  fiddling (code level to ensure chip
  select)
  - added smd solder pads for PB14/15
  - added solder pad for shorting to
  force RAM +CE2 ro 3v3 (for 128KB)
  - added label to pcb to note where
  RAM A17 is, in case we want to cut
  with exacto :O

## Power pins joined to a net without a drawn wire
+3V3: IC1.14(P:+3V3)
+5V: IC2.14(P:+5V)
GND: IC1.7(P:GND) IC2.7(P:GND)

## Library data of the parts
3V +CE2A17 B14 B15 = wirepad:WIREPAD: Wire PAD connect wire on PCB
+3V3OUT1 +5OUT1 GNDOUT1 = pinhead:PINHD-1X3: PIN HEADER
/CS3 PHI = pinhead:PINHD-1X1: PIN HEADER
AY-3-8913-CS2 = 8Bit_Parts:AY-3-8912_24PIN: Dual In Line
BOB-PA = pinhead:PINHD-1X16: PIN HEADER
BOBADDR BOBDATA BOBGPIOB BOBJTAG+ BOBMISC GPIOC-JOY0 GPIOD-JOY1 = pinhead:PINHD-1X8: PIN HEADER
BOBI2C VBATPWRJP = pinhead:PINHD-1X2: PIN HEADER
C1-C22 = rcl:C-EU: CAPACITOR, European symbol
CART-CS1 = skeezix:ZIKCART36
D1 D2 D7-D10 = diode:1N4004: DIODE general purpose rectifier, 1 A
EZ80-RESET STM-RESET = SparkFun-Electromechanical:SWITCH-MOMENTARY-2: Various NO switches- pushbuttons, reed, etc
EZ80F93 = Zilog-eZ80-v1_0:EZ80F92: eZ80L92/F92/F93 Identical pinouts for all.
GPUOSC Z-OSC = SparkFun-FreqCtrl:CRYSTAL: Various standard crystals. Proven footprints. Spark Fun Electronics SKU : COM-00534
IC1 = 74xx-us-33v-skeezix:74*32: Quad 2-input OR gate
IC2 = 74xx-us-5v-skeezix:74*04: Hex INVERTER
ISPJTAG = pinhead:PINHD-2X10: PIN HEADER
ISPZDI = pinhead:PINHD-2X3: PIN HEADER
LED2 = SparkFun-LED:LED: LEDs Standard schematic elements and footprints for 5mm, 3mm, 1206, and 0603 sized LEDs. 5mm - Spark Fun Electronics SKU : COM-00529 (and others)
OSCDIL14 = crystal:CRYSTAL_RES-: CRYSTAL RESONATOR; OC_FARNELL: unknown; OC_NEWARK: unknown
PS2KEYB PWRIN1 PWROUT1 SPKR = pinhead:PINHD-1X4: PIN HEADER
R1-R33 = rcl:R-US_: RESISTOR, American symbol
RAM-CS0 = Alliance_Memory_By_element14_Batch_1:AS6C1008-55PCN: CMOS SRAM; MPN: AS6C1008-55PCN; OC_FARNELL: 1562896; OC_NEWARK: 94M6214; PACKAGE: DIP-32; SUPPLIER: ALLIANCE MEMORY
STM32F4 = stm32f4:STM32F407V: STM32F407 100 pin LQFP reviewed: YES tested: YES
VGAHDR = pinhead:PINHD-1X6: PIN HEADER

## Net classes
1 power: width 0.254 mm